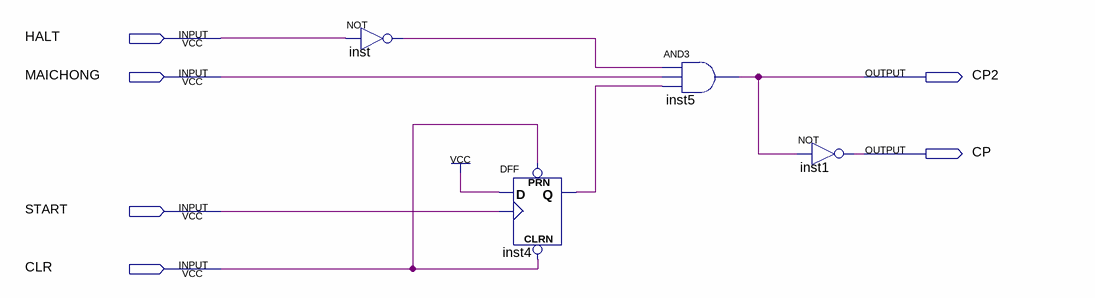
[diagram p0: schematic sheet]
// Quartus schematic StartAndHalt.bdf as structural Verilog: 4 symbols, 6 pins
module StartAndHalt (
  input  HALT,
  input  MAICHONG,
  input  START,
  input  CLR,
  output CP2,
  output CP
);

  wire inst4_q, inst_out;

  not inst (inst_out, HALT);
  DFF inst4 (.CLRN(CLR), .CLK(START), .D(1'b1), .PRN(CLR), .Q(inst4_q));
  and inst5 (CP2, inst_out, MAICHONG, inst4_q);
  not inst1 (CP, CP2);
endmodule
